# Altium schematic sheet USRF02.SchDoc
size A4
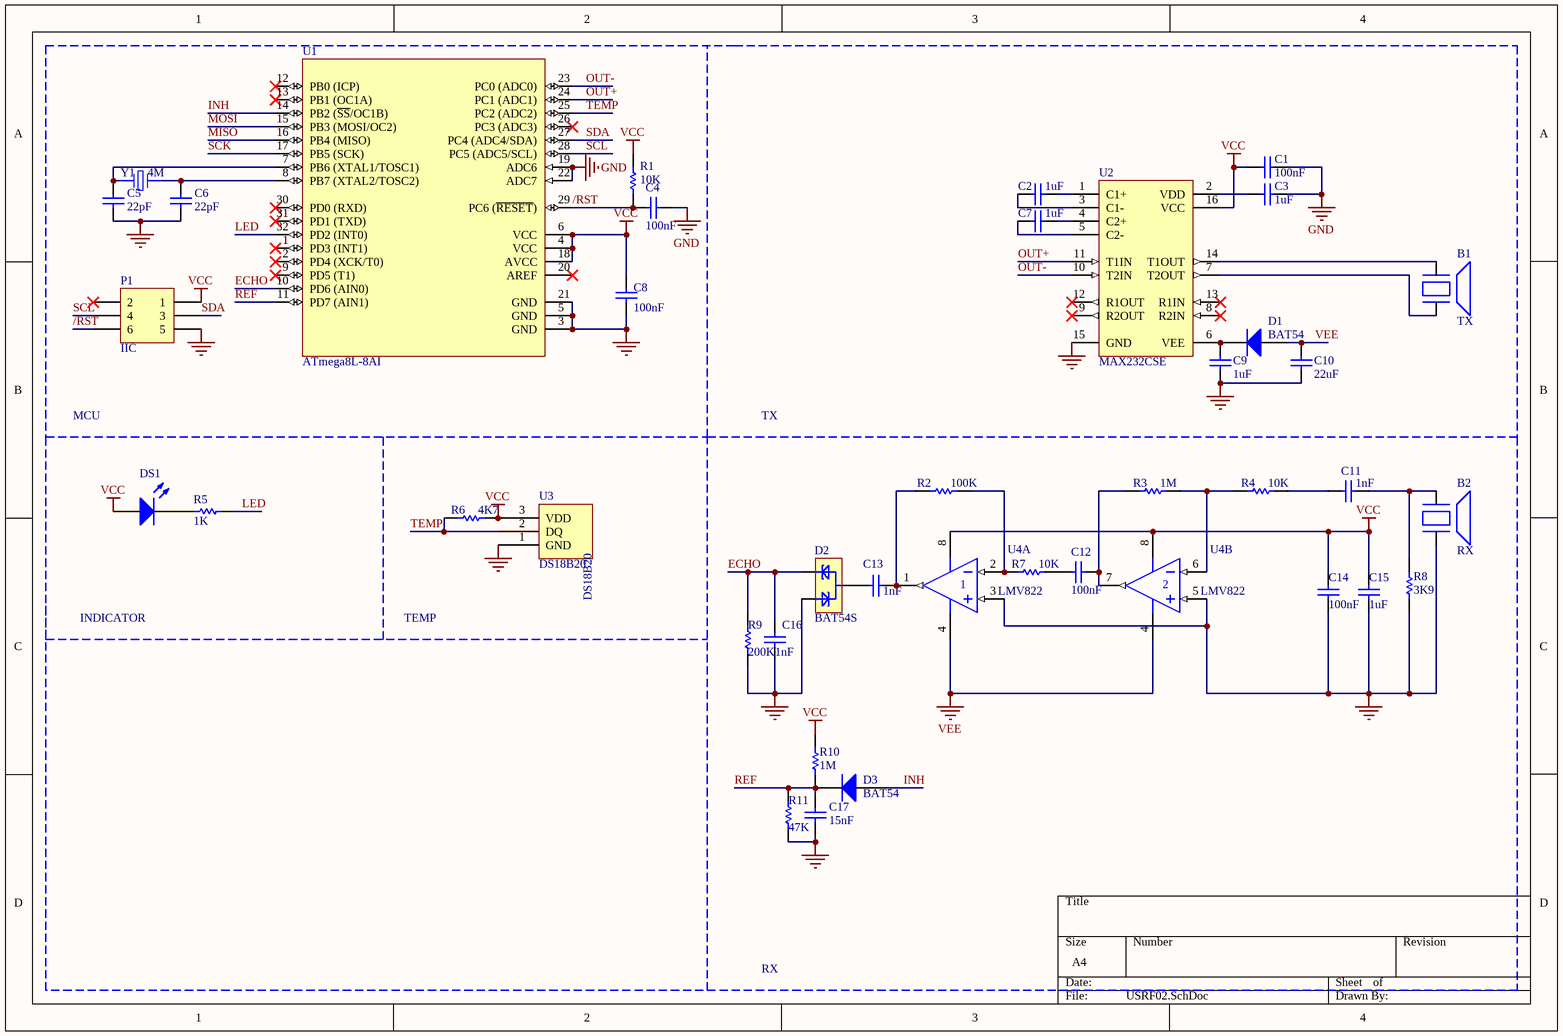
[diagram p0: USRF02.SchDoc]

## Parts
B1  TX  [TCx40-12T/R/TR]
B2  RX  [TCx40-12T/R/TR]
C1  100nF  [CAPC2012N]
C2  1uF  [CAPC2012N]
C3  1uF  [CAPC2012N]
C4  100nF  [CAPC2012N]
C5  22pF  [CAPC2012N]
C6  22pF  [CAPC2012N]
C7  1uF  [CAPC2012N]
C8  100nF  [CAPC2012N]
C9  1uF  [CAPC2012N]
C10  22uF  [CAPC2012N]
C11  1nF  [CAPC2012N]
C12  100nF  [CAPC2012N]
C13  1nF  [CAPC2012N]
C14  100nF  [CAPC2012N]
C15  1uF  [CAPC2012N]
C16  1nF  [CAPC2012N]
C17  15nF  [CAPC2012N]
D1  BAT54  [CD2012-0805]
D2  BAT54S  [SOT-23_L]
D3  BAT54  [CD2012-0805]
DS1  LED3  [CD2012-0805]  (value not drawn)
P1  IIC  [HDR2X3]
R1  10K  [RESC2012N]
R2  100K  [RESC2012N]
R3  1M  [RESC2012N]
R4  10K  [RESC2012N]
R5  1K  [RESC2012N]
R6  4K7  [RESC2012N]
R7  10K  [RESC2012N]
R8  3K9  [RESC2012N]
R9  200K  [RESC2012N]
R10  1M  [RESC2012N]
R11  47K  [RESC2012N]
U1  ATmega8L-8AI  [32A_N]
U2  MAX232CSE  [NSO16_N]
U3  DS18B20  [TO-92 (In Line)]
U4  LMV822  [M08A_N]  (parts A,B of 2)
Y1  4M  [Crystal Oscillator 1]

## Nets
GND: B2.2 C1.2 C3.2 C4.2 C5.1 C6.1 C8.2 C9.1 C10.1 C14.2 C15.2 C16.2 C17.2 D2.1 P1.5 R8.1 R9.1 R11.2 U1.3(GND) U1.5(GND) U1.19(ADC6) U1.21(GND) U1.22(ADC7) U2.15(GND) U3.1(GND) U4.3(IN+) U4.5(IN+)
VCC: C1.1 C8.1 C14.1 C15.1 DS1.1(A) P1.1 R1.2 R6.2 R10.1 U1.4(VCC) U1.6(VCC) U1.18(AVCC) U2.16(VCC) U3.3(VDD) U4.8(V+)
VEE: C10.2 D1.1(A) U4.4(V-)
/RST: C4.1 P1.6 R1.1 U1.29(PC6_(~{RESET}))
ECHO: C16.1 D2.2 R9.2 U1.10(PD6_(AIN0))
INH: D3.1(A) U1.14(PB2_(~{SS}/OC1B))
LED: R5.2 U1.32(PD2_(INT0))
MISO: U1.16(PB4_(MISO))
MOSI: U1.15(PB3_(MOSI/OC2))
OUT+: U1.24(PC1_(ADC1)) U2.11(T1IN)
OUT-: U1.23(PC0_(ADC0)) U2.10(T2IN)
REF: C17.1 D3.2(K) R10.2 R11.1 U1.11(PD7_(AIN1))
SCK: U1.17(PB5_(SCK))
SCL: P1.4 U1.28(PC5_(ADC5/SCL))
SDA: P1.3 U1.27(PC4_(ADC4/SDA))
TEMP: R6.1 U1.25(PC2_(ADC2)) U3.2(DQ)
NetB1_1: B1.1 U2.14(T1OUT)
NetB1_2: B1.2 U2.7(T2OUT)
NetB2_1: B2.1 C11.2 R8.2
NetC2_1: C2.1 U2.1(C1+)
NetC2_2: C2.2 U2.3(C1-)
NetC3_1: C3.1 U2.2(VDD)
NetC5_2: C5.2 U1.7(PB6_(XTAL1/TOSC1)) Y1.1
NetC6_2: C6.2 U1.8(PB7_(XTAL2/TOSC2)) Y1.2
NetC7_1: C7.1 U2.4(C2+)
NetC7_2: C7.2 U2.5(C2-)
NetC9_2: C9.2 D1.2(K) U2.6(VEE)
NetC11_1: C11.1 R4.2
NetC12_1: C12.1 R3.1 U4.7(OUT)
NetC12_2: C12.2 R7.2
NetC13_1: C13.1 R2.1 U4.1(OUT)
NetC13_2: C13.2 D2.3
NetDS1_2: DS1.2(K) R5.1
NetR2_2: R2.2 R7.1 U4.2(IN-)
NetR3_2: R3.2 R4.1 U4.6(IN-)

Not connected (* = marked no-connect by the designer): P1 2*; U1 1(PD3_(INT1))* 2(PD4_(XCK/T0))* 9(PD5_(T1))* 12(PB0_(ICP))* 13(PB1_(OC1A))* 20(AREF)* 26(PC3_(ADC3))* 30(PD0_(RXD))* 31(PD1_(TXD))*; U2 8(R2IN)* 9(R2OUT)* 12(R1OUT)* 13(R1IN)*

## Notes on the sheet
- MCU
- TX
- INDICATOR
- TEMP
- RX

## Library data of the parts
B1 B2 = Ultrasonic TX/RX
C1-C17 = Cap: Capacitor; Published: 8-Jun-2000; LatestRevisionDate: 17-Jul-2002; LatestRevisionNote: Re-released for DXP Platform.; Publisher: Altium Limited
  C1 C4 C8 C12 C14: Value: 100nF
  C2 C3 C7 C9 C15: Value: 1uF
  C5 C6: Value: 22pF
  C10: Value: 22uF
  C11 C13 C16: Value: 1nF
  C17: Value: 15nF
D1 D3 = Diode 1N4148: High Conductance Fast Diode; Published: 8-Jun-2000; LatestRevisionDate: 17-Jul-2002; LatestRevisionNote: Re-released for DXP Platform.; DatasheetDocument: 1997; PackageReference: DO-35; Publisher: Altium Limited; Code_JEDEC: DO-204-AH; ComponentLink1Description: Manufacturer Link; ComponentLink1URL: http://www.fairchildsemi.com/; ComponentLink2Description: Datasheet; ComponentLink2URL: http://www.fairchildsemi.com/ds/1N%2F1N4148.pdf
D2 = BAT54S: Schottky Diodes
DS1 = LED3: Typical BLUE SiC LED; Published: 8-Jun-2000; LatestRevisionDate: 17-Dec-2003; LatestRevisionNote: PCB Footprint replaced.; Publisher: Altium Limited
P1 = Header 3X2: Header, 3-Pin, Dual row; LatestRevisionDate: 17-Jul-2002; LatestRevisionNote: Re-released for DXP Platform.; Publisher: Altium Limited
R1-R11 = Res1: Resistor; Published: 8-Jun-2000; LatestRevisionDate: 17-Jul-2002; LatestRevisionNote: Re-released for DXP Platform.; Publisher: Altium Limited
  R1 R4 R7: Value: 10K
  R2: Value: 100K
  R3 R10: Value: 1M
  R5: Value: 1K
  R6: Value: 4K7
  R8: Value: 3K9
  R9: Value: 200K
  R11: Value: 47K
U1 = ATmega8L-8AI: 8-Bit AVR Microcontroller with 8K Bytes of In-System Programmable Flash Memory; Published: 17-Sep-2003; LatestRevisionDate: 13-Apr-2006; LatestRevisionNote: IPC-7351 Footprint Added.; DatasheetVersion: 2486H-AVR-09/02; PackageVersion: revB, Oct-2001; PackageReference: 32A; Publisher: Altium Limited; PackageDescription: 32-Pin Thin Quad Flat Pack 0.8 mm Pitch; Code_JEDEC: MS-026-ABA; ComponentLink1Description: Manufacturer Link; ComponentLink1URL: http://www.atmel.com; ComponentLink2Description: Datasheet; ComponentLink2URL: http://www.atmel.com/dyn/resources/prod_documents/doc2486.pdf
U2 = MAX232CSE: +5V Powered, Multi-Channel RS-232 Driver/Receiver; Published: 16-Jan-2001; PackageReference: NSO16; Publisher: Altium Limited; LatestRevisionDate: 13-Apr-2006; LatestRevisionNote: IPC-7351 Footprint Added.; PackageDescription: 16-Pin Small Outline Integrated Circuit 1.27 mm Pitch; Code_JEDEC: MS-012-AC; Code_IPC: SOIC127P600-16; ComponentLink1Description: Manufacturer Link; ComponentLink1URL: http://www.maxim-ic.com/; ComponentLink2Description: Datasheet; ComponentLink2URL: http://pdfserv.maxim-ic.com/en/ds/MAX220-MAX249.pdf
U3 = DS18B20: Programmable Resolution 1-Wire Digital Thermometer
U4 = LMV358M: Dual General-Purpose, Low-Voltage Rail-to-Rail Output Operational Amplifier; Published: 15-Apr-2002; LatestRevisionDate: 13-Apr-2006; LatestRevisionNote: IPC-7351 Footprint Added.; DatasheetVersion: Aug-1999; PackageVersion: Sep-1997; PackageReference: M08A; Publisher: Altium Limited; PackageDescription: 8-Pin Small Outline Integrated Circuit 1.27 mm Pitch; Code_IPC: SOIC127P600-8; ComponentLink1Description: Manufacturer Link; ComponentLink1URL: http://www.national.com/; ComponentLink2Description: Datasheet; ComponentLink2URL: http://www.national.com/ds.cgi/LM/LMV321.pdf; Code_JEDEC: MS-012-AA; ComponentLink3Description: URL Link1; ComponentLink3URL: http://www.national.com/pf/LM/LMV358.html
Y1 = Crystal Oscillator 1: 2 Pins crystal